# Altium schematic sheet TOP.SchDoc
size A4; SheetNumber: 1; SheetTotal: 7
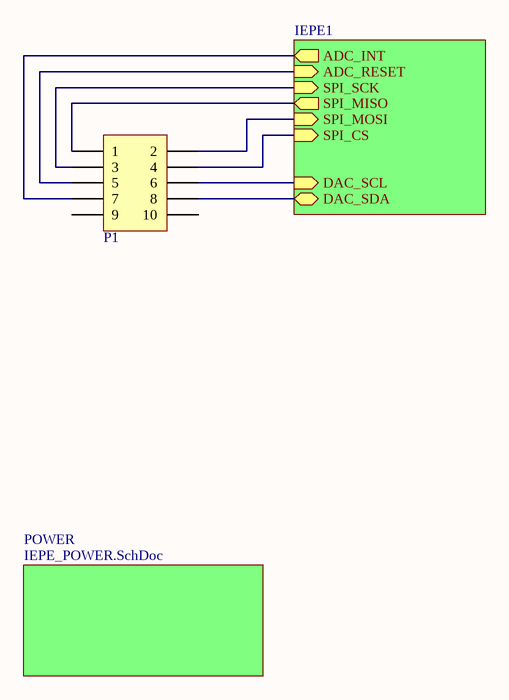
[diagram p0: TOP.SchDoc]

## Parts
P1  Box Header  [BoxHDR-2x5]  (value not drawn)

## Sub-sheets
IEPE1 = IEPE.SchDoc: ADC_RESET (in), ADC_INT (out), DAC_SCL (in), DAC_SDA (bidir), SPI_SCK (in), SPI_MISO (out), SPI_MOSI (in), SPI_CS (in)
POWER = IEPE_POWER.SchDoc: no entries

## Nets
NetP1_1: P1.1 ; sheet IEPE1/SPI_MISO
NetP1_2: P1.2 ; sheet IEPE1/SPI_MOSI
NetP1_3: P1.3 ; sheet IEPE1/SPI_SCK
NetP1_4: P1.4 ; sheet IEPE1/SPI_CS
NetP1_5: P1.5 ; sheet IEPE1/ADC_RESET
NetP1_6: P1.6 ; sheet IEPE1/DAC_SCL
NetP1_7: P1.7 ; sheet IEPE1/ADC_INT
NetP1_8: P1.8 ; sheet IEPE1/DAC_SDA

Not connected (* = marked no-connect by the designer): P1 9 10

## Library data of the parts
P1 = BoxHdr-2x5